# EAGLE design Shift Register Module v0.6 (EAGLE 7.7.0)
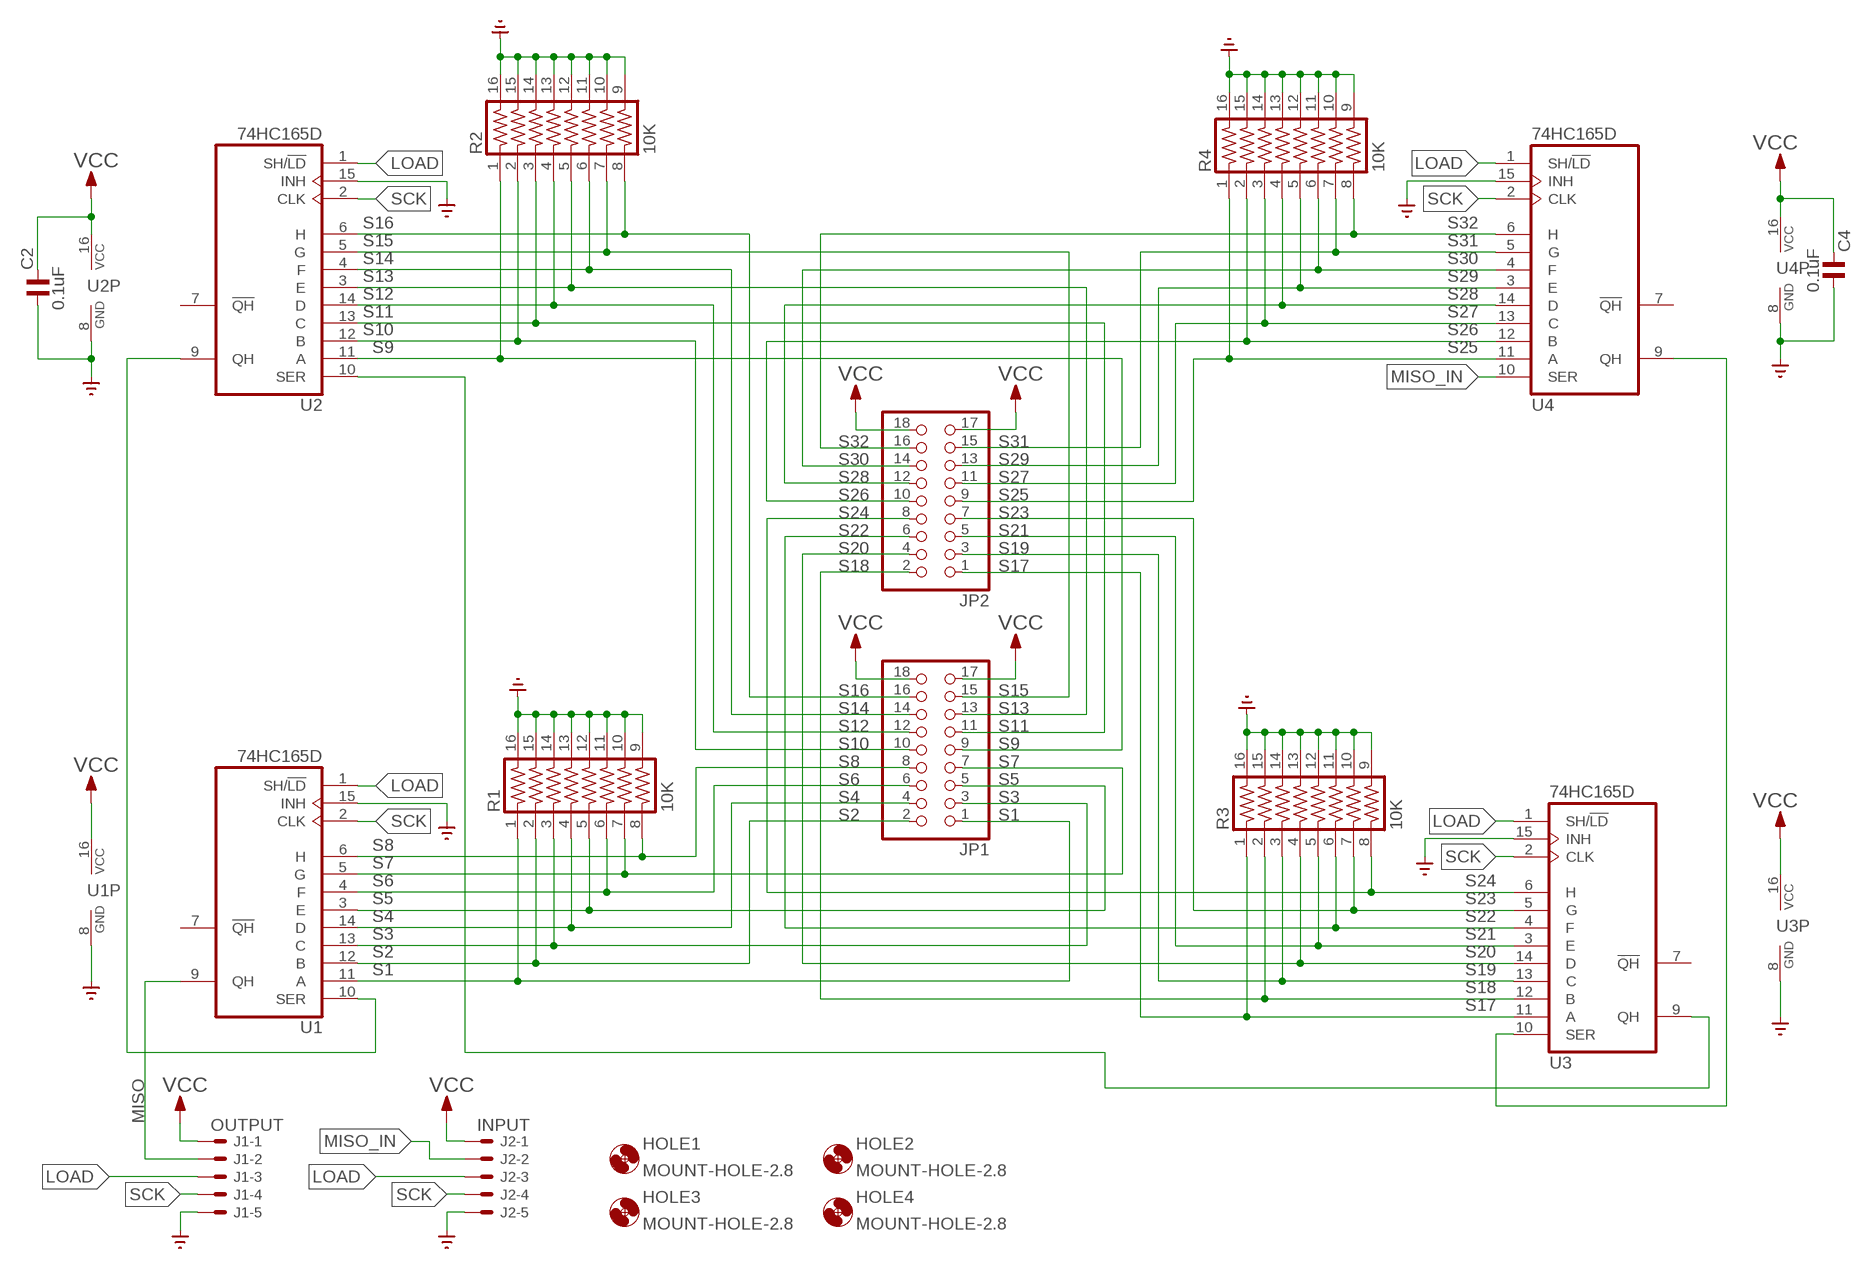
[diagram p0: schematic, sheet 1]

## Parts
C2  0.1uF  C_0805MP  [C0805MP]
C4  0.1uF  C_0805MP  [C0805MP]
HOLE1  MOUNT-HOLE-2.8  [2,8]
HOLE2  MOUNT-HOLE-2.8  [2,8]
HOLE3  MOUNT-HOLE-2.8  [2,8]
HOLE4  MOUNT-HOLE-2.8  [2,8]
J1  OUTPUT  22-05-7058-05  [7395-05]
J2  INPUT  22-05-7058-05  [7395-05]
JP1  PINHD-2X9-SHROUDED  [2X09]
JP2  PINHD-2X9-SHROUDED  [2X09]
R1  10K  4816P-T01  [4816P]
R2  10K  4816P-T01  [4816P]
R3  10K  4816P-T01  [4816P]
R4  10K  4816P-T01  [4816P]
U1  74HC165D  [SO16]
U2  74HC165D  [SO16]
U3  74HC165D  [SO16]
U4  74HC165D  [SO16]

## Nets
GND: C2.1 C4.1 J1.5 J2.5 R1.9 R1.10 R1.11 R1.12 R1.13 R1.14 R1.15 R1.16 R2.9 R2.10 R2.11 R2.12 R2.13 R2.14 R2.15 R2.16 R3.9 R3.10 R3.11 R3.12 R3.13 R3.14 R3.15 R3.16 R4.9 R4.10 R4.11 R4.12 R4.13 R4.14 R4.15 R4.16 U1.8(GND) U1.15(INH) U2.8(GND) U2.15(INH) U3.8(GND) U3.15(INH) U4.8(GND) U4.15(INH)
LOAD: J1.3 J2.3 U1.1(SH/!LD) U2.1(SH/!LD) U3.1(SH/!LD) U4.1(SH/!LD)
MISO: J1.2 U1.9(QH)
MISO_IN: J2.2 U4.10(SER)
N$1: U1.10(SER) U2.9(QH)
N$3: U2.10(SER) U3.9(QH)
S1: JP1.1 R1.1 U1.11(A)
S2: JP1.2 R1.2 U1.12(B)
S3: JP1.3 R1.3 U1.13(C)
S4: JP1.4 R1.4 U1.14(D)
S5: JP1.5 R1.5 U1.3(E)
S6: JP1.6 R1.6 U1.4(F)
S7: JP1.7 R1.7 U1.5(G)
S8: JP1.8 R1.8 U1.6(H)
S9: JP1.9 R2.1 U2.11(A)
S10: JP1.10 R2.2 U2.12(B)
S11: JP1.11 R2.3 U2.13(C)
S12: JP1.12 R2.4 U2.14(D)
S13: JP1.13 R2.5 U2.3(E)
S14: JP1.14 R2.6 U2.4(F)
S15: JP1.15 R2.7 U2.5(G)
S16: JP1.16 R2.8 U2.6(H)
S17: JP2.1 R3.1 U3.11(A)
S18: JP2.2 R3.2 U3.12(B)
S19: JP2.3 R3.3 U3.13(C)
S20: JP2.4 R3.4 U3.14(D)
S21: JP2.5 R3.5 U3.3(E)
S22: JP2.6 R3.6 U3.4(F)
S23: JP2.7 R3.7 U3.5(G)
S24: JP2.8 R3.8 U3.6(H)
S25: JP2.9 R4.1 U4.11(A)
S26: JP2.10 R4.2 U4.12(B)
S27: JP2.11 R4.3 U4.13(C)
S28: JP2.12 R4.4 U4.14(D)
S29: JP2.13 R4.5 U4.3(E)
S30: JP2.14 R4.6 U4.4(F)
S31: JP2.15 R4.7 U4.5(G)
S32: JP2.16 R4.8 U4.6(H)
SCK: J1.4 J2.4 U1.2(CLK) U2.2(CLK) U3.2(CLK) U4.2(CLK)
VCC: C2.2 C4.2 J1.1 J2.1 JP1.17 JP1.18 JP2.17 JP2.18 U1.16(VCC) U2.16(VCC) U3.16(VCC) U4.16(VCC)
XX: U3.10(SER) U4.9(QH)
Unconnected: U1.7(!QH) U2.7(!QH) U3.7(!QH) U4.7(!QH)

## Library data of the parts
C2 C4 = rc-master:C_: NON-POLARIZED CAP
HOLE1-HOLE4 = holes:MOUNT-HOLE-: MOUNTING HOLE with drill center marker; BOM: EXCLUDE
J1 J2 = con-molex:22-?-05: CONNECTOR wire to board 2.54 mm (.1 inch) pitch header
JP1 JP2 = jdc:PINHD-2X9-SHROUDED: PIN HEADER
R1-R4 = resistor-bourns:4816P-T01: BOURNS RESISTOR NETWORK
U1-U4 = 74xx-eu:74*165: 8-bit parallel load SHIFT REGISTER

## Board
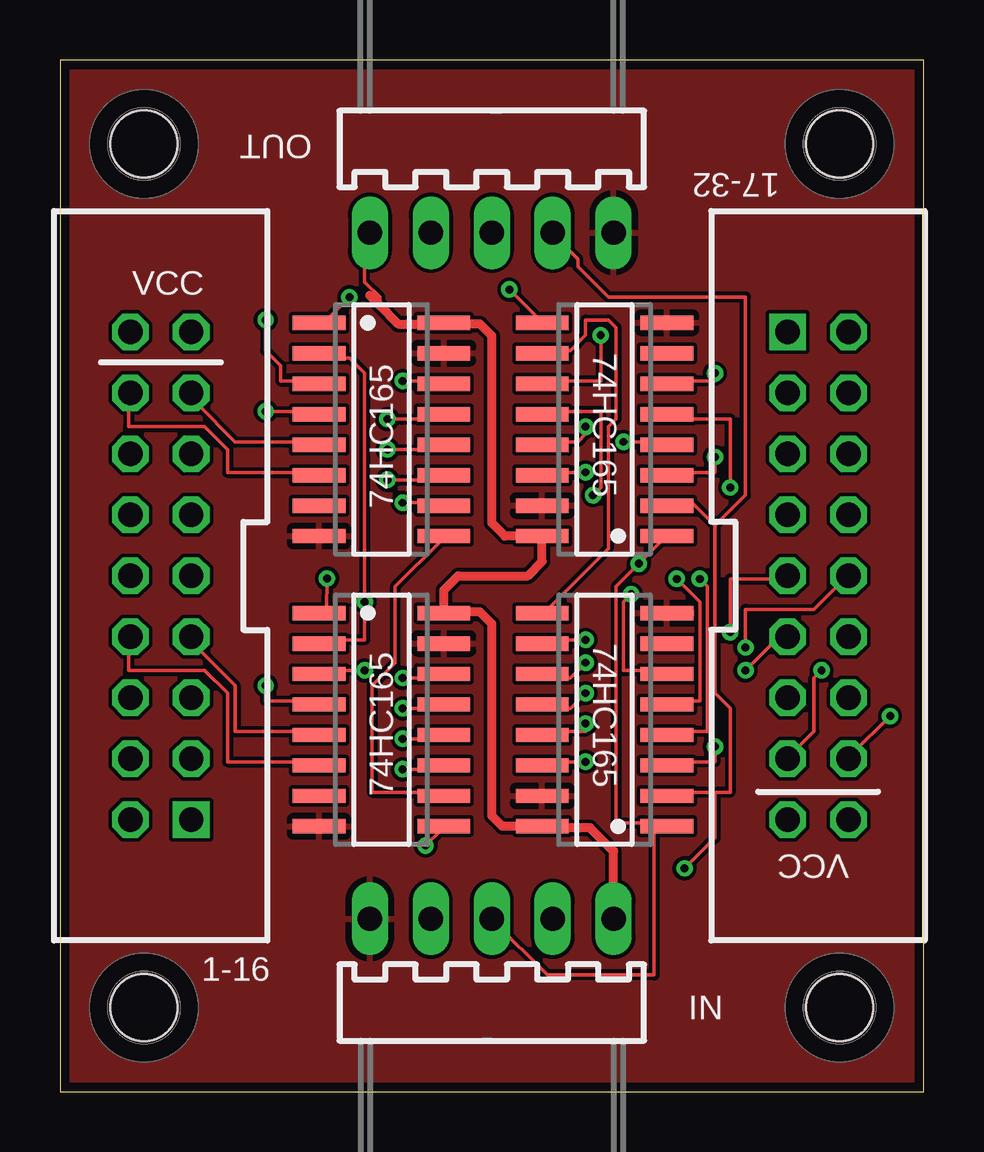
[diagram p1: board, top side]
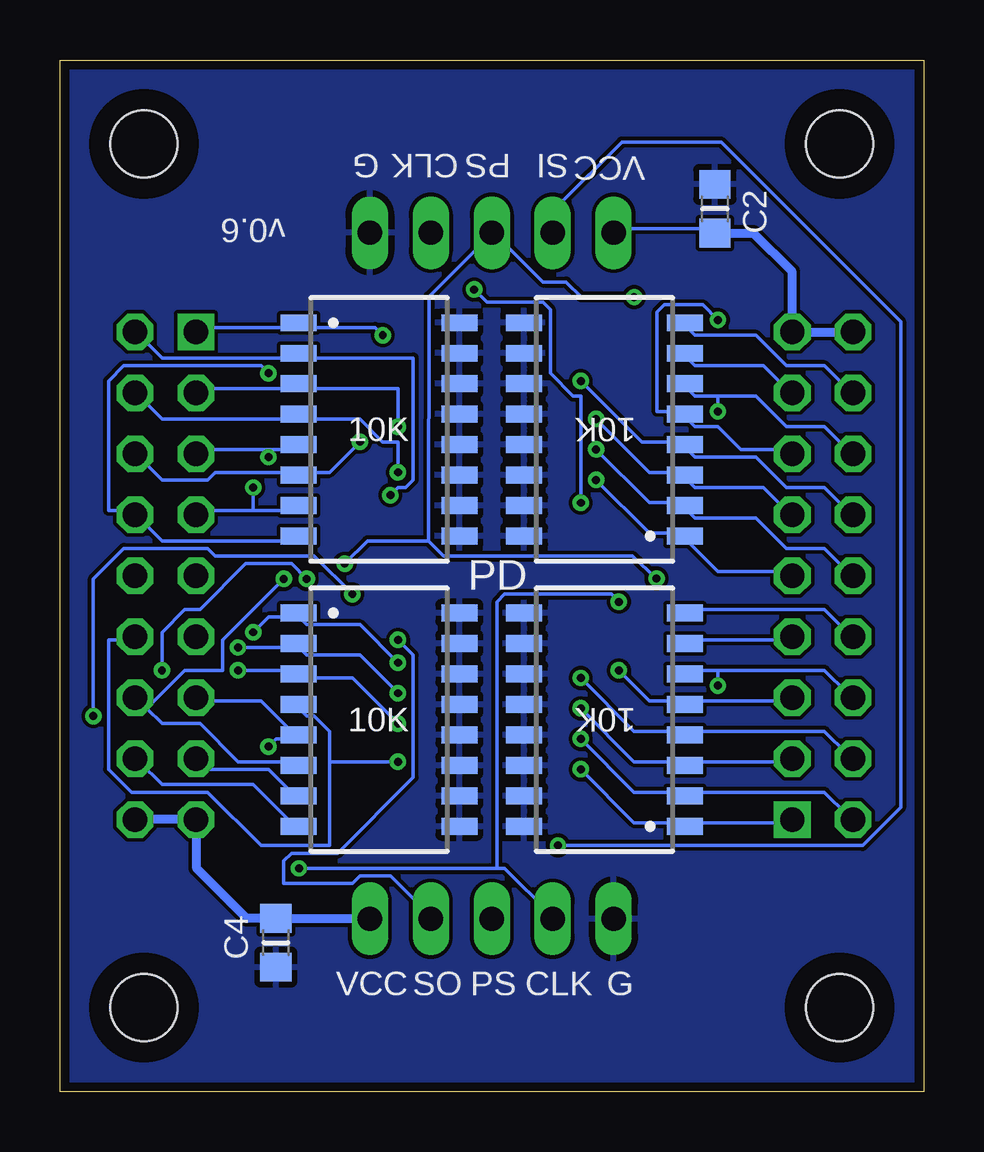
[diagram p2: board, bottom side, seen from below]

Size 36 x 43 mm. Coordinates in mm from the lower left corner, seen from the top.
Outline: 0,0 36,0 36,43 0,43 0,0
Copper layers (1*16): Top 0.0356mm / dielectric 1.5011mm / Bottom 0.0356mm
Design rules "LaenPCBOrder *": minimum track width 6mil, minimum drill 13mil, track to track 6mil, track to pad 6mil, pad to pad 6mil, via to via 6mil, smd to smd 6mil, copper to edge 15mil, drill to drill 6mil, minimum pad ring 7mil, minimum via ring 7mil, stop-mask expansion 4mm, vias tented up to drill 0.6mm, thermal gap 10mil

### Footprints (pad centres in the part's own frame; a part is rotated, then mirrored left to right if it is on the bottom)
C0805MP = smd 1.2 x 1.3: 1 -1.016,0; 2 1.016,0
2,8 = hole 2.8: 0,0
7395-05 = drill 1.016 long: 1 5.08,0; 2 2.54,0; 3 0,0; 4 -2.54,0; 5 -5.08,0
2X09 = drill 1.016 square: 1 -10.16,-1.27 | drill 1.016 octagon: 2 -10.16,1.27; 3 -7.62,-1.27; 4 -7.62,1.27; 5 -5.08,-1.27; 6 -5.08,1.27; 7 -2.54,-1.27; 8 -2.54,1.27; 9 0,-1.27; 10 0,1.27; 11 2.54,-1.27; 12 2.54,1.27; 13 5.08,-1.27; 14 5.08,1.27; 15 7.62,-1.27; 16 7.62,1.27; 17 10.16,-1.27; 18 10.16,1.27
4816P = smd 0.7 x 1.5: 1 -4.445,-3.346; 2 -3.175,-3.346; 3 -1.905,-3.346; 4 -0.635,-3.346; 5 0.635,-3.346; 6 1.905,-3.346; 7 3.175,-3.346; 8 4.445,-3.346; 9 4.445,3.346; 10 3.175,3.346; 11 1.905,3.346; 12 0.635,3.346; 13 -0.635,3.346; 14 -1.905,3.346; 15 -3.175,3.346; 16 -4.445,3.346
SO16 = smd 0.6 x 2.2: 1 -4.445,-2.6; 2 -3.175,-2.6; 3 -1.905,-2.6; 4 -0.635,-2.6; 5 0.635,-2.6; 6 1.905,-2.6; 7 3.175,-2.6; 8 4.445,-2.6; 9 4.445,2.6; 10 3.175,2.6; 11 1.905,2.6; 12 0.635,2.6; 13 -0.635,2.6; 14 -1.905,2.6; 15 -3.175,2.6; 16 -4.445,2.6

### Placement (x,y rotation side)
C2  8.7,36.8 270 bottom
C4  27,6.2 90 bottom
HOLE1  3.5,3.5 0 top
HOLE2  3.5,39.5 0 top
HOLE3  32.5,3.5 0 top
HOLE4  32.5,39.5 0 top
J1  18,35.8 180 top
J2  18,7.2 0 top
JP1  4.2,21.5 90 top
JP2  31.6,21.5 270 top
R1  13.3,15.5 90 bottom
R2  13.3,27.6 90 bottom
R3  22.7,27.6 270 bottom
R4  22.7,15.5 270 bottom
U1  13.4,15.5 270 top
U2  13.4,27.6 270 top
U3  22.7,27.6 90 top
U4  22.7,15.5 90 top

### Tracks (layer width: path | path; a pad name or v marks a point on that pad's centre or on a via)
GND
  pour Top: -1,-1 37,-1 37,44 -1,44
  pour Bottom: -2,-2 38,-2 38,45 -2,45
LOAD  (via drill 0.33)
  Top 0.152: 24.77,11.21 23.18,11.21 23.18,21.05 v24.13,22 25.08,22.95 U3.1 | 24.77,11.21 25.08,11.21 U4.1 24.77,11.21 | 24.77,11.21 24.77,4.86 20.32,4.86 18.1,7.08 J2.3 | v11.13,21.39 11.11,20.1 U1.1 | v12.06,33.12 11.11,32.16 U2.1
  Bottom 0.152: v11.13,21.39 12.13,22.32 20,22.32 20.64,22.95 | 20.64,22.95 20.62,33.14 20,33.75 18.1,35.66 J1.3 17.78,35.66 15.88,33.75 14.9,33.75 14.27,33.12 v12.06,33.12 | v24.13,22 23.18,22.95 20.64,22.95
MISO  (via drill 0.33)
  Top 0.152: v15.24,10.26 15.88,10.89 U1.9
  Bottom 0.152: v15.24,10.26 2.54,10.26 0.95,11.84 0.95,32.1 8.44,39.58 12.58,39.58 15.24,36.92 15.24,35.97 J1.2
MISO_IN  (via drill 0.33)
  Top 0.152: v21.91,18.83 20.32,18.83 U4.10
  Bottom 0.152: v21.91,18.83 21.27,18.19 21.27,13.1 24.43,9.94 26.35,9.94 26.67,9.62 26.67,8.67 23.81,8.67 23.5,8.98 22.23,8.98 20.64,7.4 J2.2
N$1
  Top 0.152: U1.10 15.88,12.48 13.02,12.48 13.02,16.92 13.97,17.88 13.97,21.05 15.88,22.95 U2.9
N$3  (via drill 0.33)
  Top 0.152: v14.29,24.54 15.88,24.54 U2.10 | v18.73,33.43 20,32.16 U3.9
  Bottom 0.152: v14.29,24.54 14.29,28.99 14.61,28.99 15.56,29.94 15.56,32.6 15.86,32.9 18.2,32.9 v18.73,33.43
S1  (via drill 0.33)
  Top 0.152: v14.29,13.43 15.88,13.43 U1.11
  Bottom 0.152: JP1.1 5.71,11.21 9.84,11.21 R1.1 10.16,11.21 12.06,11.21 v14.29,13.43
S2  (via drill 0.33)
  Top 0.152: v14.29,14.7 15.88,14.7 U1.12
  Bottom 0.152: JP1.2 3.17,11.53 4.13,12.48 9.84,12.48 R1.2 10.16,12.48 12.06,12.48 v14.29,14.7
S3  (via drill 0.33)
  Top 0.152: v14.29,15.97 15.88,15.97 U1.13
  Bottom 0.152: JP1.3 5.71,13.75 9.84,13.75 R1.3 10.16,13.75 12.06,13.75 v14.29,15.97
S4  (via drill 0.33)
  Top 0.152: v14.29,17.24 15.88,17.24 U1.14
  Bottom 0.152: JP1.4 3.17,14.06 4.13,15.02 9.84,15.02 R1.4 10.16,15.02 12.06,15.02 v14.29,17.24
S5  (via drill 0.33)
  Top 0.152: v12.7,17.56 11.11,17.56 U1.3
  Bottom 0.152: JP1.5 5.71,16.29 9.84,16.29 R1.5 10.16,16.29 11.43,16.29 v12.7,17.56
S6  (via drill 0.33)
  Top 0.152: v8.57,16.92 8.57,16.29 10.79,16.29 U1.4
  Bottom 0.152: 8.57,17.56 4.13,17.56 3.17,16.61 JP1.6 | 8.57,17.56 9.84,17.56 R1.6 | 8.57,17.56 v8.57,16.92
S7
  Top 0.152: U1.5 10.79,15.02 7.3,15.02 7.3,16.92 5.71,18.51 5.71,18.83 JP1.7
  Bottom 0.152: R1.7 9.84,18.83 5.71,18.83 JP1.7
S8
  Top 0.152: U1.6 10.79,13.75 6.99,13.75 6.99,16.61 6.03,17.56 2.86,17.56 2.86,18.83 JP1.8
  Bottom 0.152: R1.8 9.84,20.1 4.13,20.1 3.17,19.14 JP1.8
S9  (via drill 0.33)
  Top 0.152: v13.65,25.5 15.88,25.5 U2.11
  Bottom 0.152: JP1.9 5.71,21.68 8.57,21.68 9.84,22.95 R2.1 10.16,23.27 11.43,23.27 v13.65,25.5
S10  (via drill 0.33)
  Top 0.152: v13.65,26.77 15.88,26.77 U2.12
  Bottom 0.152: JP1.10 3.17,21.68 4.13,22.64 5.71,22.64 6.99,23.91 9.53,23.91 9.84,24.23 R2.2 10.16,24.54 11.43,24.54 v13.65,26.77
S11  (via drill 0.33)
  Top 0.152: v13.65,28.04 15.88,28.04 U2.13
  Bottom 0.152: JP1.11 5.71,24.23 6.67,25.18 9.53,25.18 9.84,25.5 R2.3 10.16,25.81 11.43,25.81 v13.65,28.04
S12  (via drill 0.33)
  Top 0.152: v14.29,29.62 15.88,29.62 U2.14
  Bottom 0.152: JP1.12 3.17,24.23 4.13,25.18 5.71,25.18 6.99,26.45 9.53,26.45 9.84,26.77 R2.4 10.16,27.08 11.75,27.08 v14.29,29.62
S13  (via drill 0.33)
  Top 0.152: v8.57,32.16 8.57,30.89 9.21,30.26 9.21,29.62 10.79,29.62 U2.3
  Bottom 0.152: JP1.13 5.71,26.77 7.62,26.77 8.57,27.72 9.53,27.72 9.84,28.04 R2.5 10.16,28.35 11.11,28.35 11.11,32.48 10.79,32.8 9.21,32.8 v8.57,32.16
S14  (via drill 0.33)
  Top 0.152: v8.57,28.35 10.79,28.35 U2.4
  Bottom 0.152: 8.57,28.99 6.99,28.99 5.71,27.72 4.13,27.72 3.17,26.77 JP1.14 | 8.57,28.99 9.53,28.99 9.84,29.3 R2.6 | 8.57,28.99 v8.57,28.35
S15
  Top 0.152: U2.5 10.79,27.08 7.3,27.08 5.71,28.67 5.71,28.99 JP1.15
  Bottom 0.152: R2.7 9.84,30.57 9.53,30.26 6.67,30.26 5.71,29.3 JP1.15
S16
  Top 0.152: U2.6 10.79,25.81 6.99,25.81 6.99,26.77 6.03,27.72 2.86,27.72 2.86,28.99 JP1.16
  Bottom 0.152: R2.8 9.84,31.84 9.53,31.53 6.99,31.53 5.71,30.26 4.13,30.26 3.17,29.3 JP1.16
S17  (via drill 0.33)
  Top 0.152: v22.54,31.53 22.54,29.62 20.32,29.62 U3.11
  Bottom 0.152: JP2.1 30.16,31.84 26.35,31.84 R3.1 26.04,31.84 22.86,31.84 v22.54,31.53
S18  (via drill 0.33)
  Top 0.152: v22.23,24.86 22.54,25.18 22.54,28.35 20.32,28.35 U3.12
  Bottom 0.152: JP2.2 32.7,31.53 31.75,30.57 26.35,30.57 R3.2 26.04,30.57 21.27,30.57 21.27,25.5 21.59,25.18 21.91,25.18 v22.23,24.86
S19  (via drill 0.33)
  Top 0.152: v21.91,27.72 21.91,27.4 21.59,27.08 20.32,27.08 U3.13
  Bottom 0.152: JP2.3 30.16,29.3 26.35,29.3 R3.3 26.04,29.3 21.91,29.3 v21.91,27.72
S20  (via drill 0.33)
  Top 0.152: v21.91,25.81 20.32,25.81 U3.14
  Bottom 0.152: JP2.4 32.7,28.99 31.75,28.04 26.35,28.04 R3.4 26.04,28.04 23.5,28.04 22.54,27.08 21.91,27.08 v21.91,25.81
S21  (via drill 0.33)
  Top 0.152: v27.3,26.45 27.3,25.81 25.4,25.81 U3.3
  Bottom 0.152: 27.3,26.77 30.16,26.77 JP2.5 | 27.3,26.77 26.35,26.77 R3.5 | 27.3,26.77 v27.3,26.45
S22  (via drill 0.33)
  Top 0.152: v23.5,27.08 25.08,27.08 U3.4
  Bottom 0.152: JP2.6 32.7,26.45 31.75,25.5 29.84,25.5 29.53,25.81 26.35,25.81 R3.6 26.04,25.81 24.77,25.81 v23.5,27.08
S23  (via drill 0.33)
  Top 0.152: v27.94,25.18 27.94,28.04 25.4,28.04 U3.5
  Bottom 0.152: 27.94,24.23 30.16,24.23 JP2.7 | 27.94,24.23 26.35,24.23 R3.7 | 27.94,24.23 v27.94,25.18
S24  (via drill 0.33)
  Top 0.152: v27.3,29.94 27.3,29.62 25.4,29.62 U3.6
  Bottom 0.152: R3.8 26.35,22.95 31.75,22.95 32.7,23.91 JP2.8 33.02,24.23 33.97,24.23 33.97,29.62 33.34,30.26 27.62,30.26 v27.3,29.94
S25  (via drill 0.33)
  Top 0.152: v21.91,17.88 21.27,17.24 20.32,17.24 U4.11 | v27.94,19.14 27.94,21.37 30.16,21.37 JP2.9
  Bottom 0.152: v21.91,17.88 23.5,19.46 25.72,19.46 26.04,19.78 R4.1 26.35,19.78 27.3,19.78 v27.94,19.14
S26  (via drill 0.33)
  Top 0.152: v21.91,16.61 21.27,15.97 20.32,15.97 U4.12 | v28.57,18.51 28.57,20.1 31.43,20.1 32.7,21.37 JP2.10
  Bottom 0.152: v21.91,16.61 23.5,18.19 25.72,18.19 26.04,18.51 R4.2 26.35,18.51 v28.57,18.51
S27  (via drill 0.33)
  Top 0.152: v28.57,17.56 30.16,19.14 JP2.11 | v21.91,15.34 21.91,15.02 20.32,15.02 U4.13
  Bottom 0.152: v28.57,17.56 26.35,17.56 R4.3 26.04,17.24 23.81,17.24 v21.91,15.34
S28  (via drill 0.33)
  Top 0.152: v21.91,13.75 20.32,13.75 U4.14
  Bottom 0.152: 24.77,13.75 24.77,10.26 27.62,10.26 29.84,12.48 33.02,12.48 33.97,13.43 33.97,18.83 33.02,18.83 JP2.12 | 24.77,13.75 24.77,15.02 25.4,15.65 25.72,15.65 26.04,15.97 R4.4 | 24.77,13.75 v21.91,13.75
S29  (via drill 0.33)
  Top 0.152: v27.3,14.38 27.3,13.75 25.4,13.75 U4.3
  Bottom 0.152: JP2.13 30.16,16.29 27.62,16.29 26.35,15.02 R4.5 26.35,14.7 26.99,14.7 v27.3,14.38
S30  (via drill 0.33)
  Top 0.152: v26.67,21.37 26.99,21.05 26.99,15.02 25.4,15.02 U4.4
  Bottom 0.152: 32.38,15.97 32.7,16.29 JP2.14 32.38,15.97 | 32.38,15.97 31.75,15.34 30.16,15.34 28.57,13.75 26.35,13.75 R4.6 | v26.67,21.37 29.21,18.83 29.21,17.56 30.8,17.56 32.38,15.97
S31  (via drill 0.33)
  Top 0.152: v25.72,21.37 26.67,20.41 26.67,16.29 25.4,16.29 U4.5 | v31.75,17.56 31.43,17.24 31.43,15.02 30.48,14.06 JP2.15
  Bottom 0.152: R4.7 26.35,12.48 27.3,13.43 29.84,13.43 30.16,13.75 JP2.15 | v25.72,21.37 26.35,22 28.26,22 30.16,20.1 30.8,20.1 31.75,19.14 v31.75,17.56
S32  (via drill 0.33)
  Top 0.152: v23.81,20.73 23.5,20.41 23.5,17.56 25.08,17.56 U4.6 | v34.61,15.65 33.02,14.06 JP2.16
  Bottom 0.152: R4.8 26.35,11.21 27.94,12.79 31.75,12.79 32.7,13.75 JP2.16 | v23.81,20.73 25.4,22.32 29.53,22.32 29.84,22.64 33.34,22.64 34.61,21.37 v34.61,15.65
SCK  (via drill 0.33)
  Top 0.152: U1.2 11.11,18.83 12.7,18.83 v12.7,20.41 12.7,29.94 12.06,30.57 11.11,30.57 U2.2 | 27.3,12.48 27.94,12.48 27.94,15.97 27.3,16.61 27.3,23.59 | 27.3,12.48 25.4,12.48 U4.2 | 27.3,23.59 26.35,24.54 25.4,24.54 U3.2 | v26.04,9.3 27.3,10.57 27.3,12.48 | 27.3,23.59 28.57,24.86 28.57,33.12 22.86,33.12 21.59,34.38 21.59,34.7 20.64,35.66 J1.4
  Bottom 0.152: v26.04,9.3 17.78,9.3 | 17.78,9.3 17.46,9.3 15.56,7.4 J2.4 | v12.7,20.41 13.02,20.73 17.46,20.73 17.78,20.41 17.78,9.3
VCC
  Top 0.152: J1.1 12.7,35.66 12.7,33.75 13.34,33.12 13.34,32.8 13.32,32.78
  Top 0.381: 12.92,33.18 13.32,32.78 14.1,32 15.96,32 U2.16 16.05,32 17.5,32 18,31.5 18,23.7 18.55,23.16 U3.16 20.1,22.1 19.5,21.5 16.6,21.5 16,20.9 U1.16 16.05,20 17.5,20 18,19.5 18,11.5 18.45,11.05 U4.16 20.16,11 22.1,11 23.08,10.02 J2.1
  Bottom 0.152: J1.1 12.7,35.97 8.89,35.97 C2.2
  Bottom 0.381: J2.1 26.98,7.2 C4.2 28.22,7.22 30.3,9.3 30.3,11.31 JP2.17 JP2.18 | 8.72,35.8 C2.2 7.08,35.78 5.5,34.2 5.5,31.69 JP1.17 JP1.18
XX
  Top 0.152: U4.9 20.32,20.1 22.86,22.64 22.86,27.72 23.18,28.04 23.18,31.84 22.86,32.16 21.91,32.16 21.91,31.53 21.27,30.89 20.32,30.89 U3.10

### Text on the board
tPlace: 17-32 | VCC | 74HC165 | 74HC165 | 74HC165 | 74HC165 | VCC | 1-16
bPlace: v0.6 | 10K | 10K | 10K | 10K
tNames: OUT | IN
bNames: VCC | SI | PS | CLK | G | PD | G | CLK | PS | SO | VCC